# EAGLE design Duodecima (EAGLE 5.11)
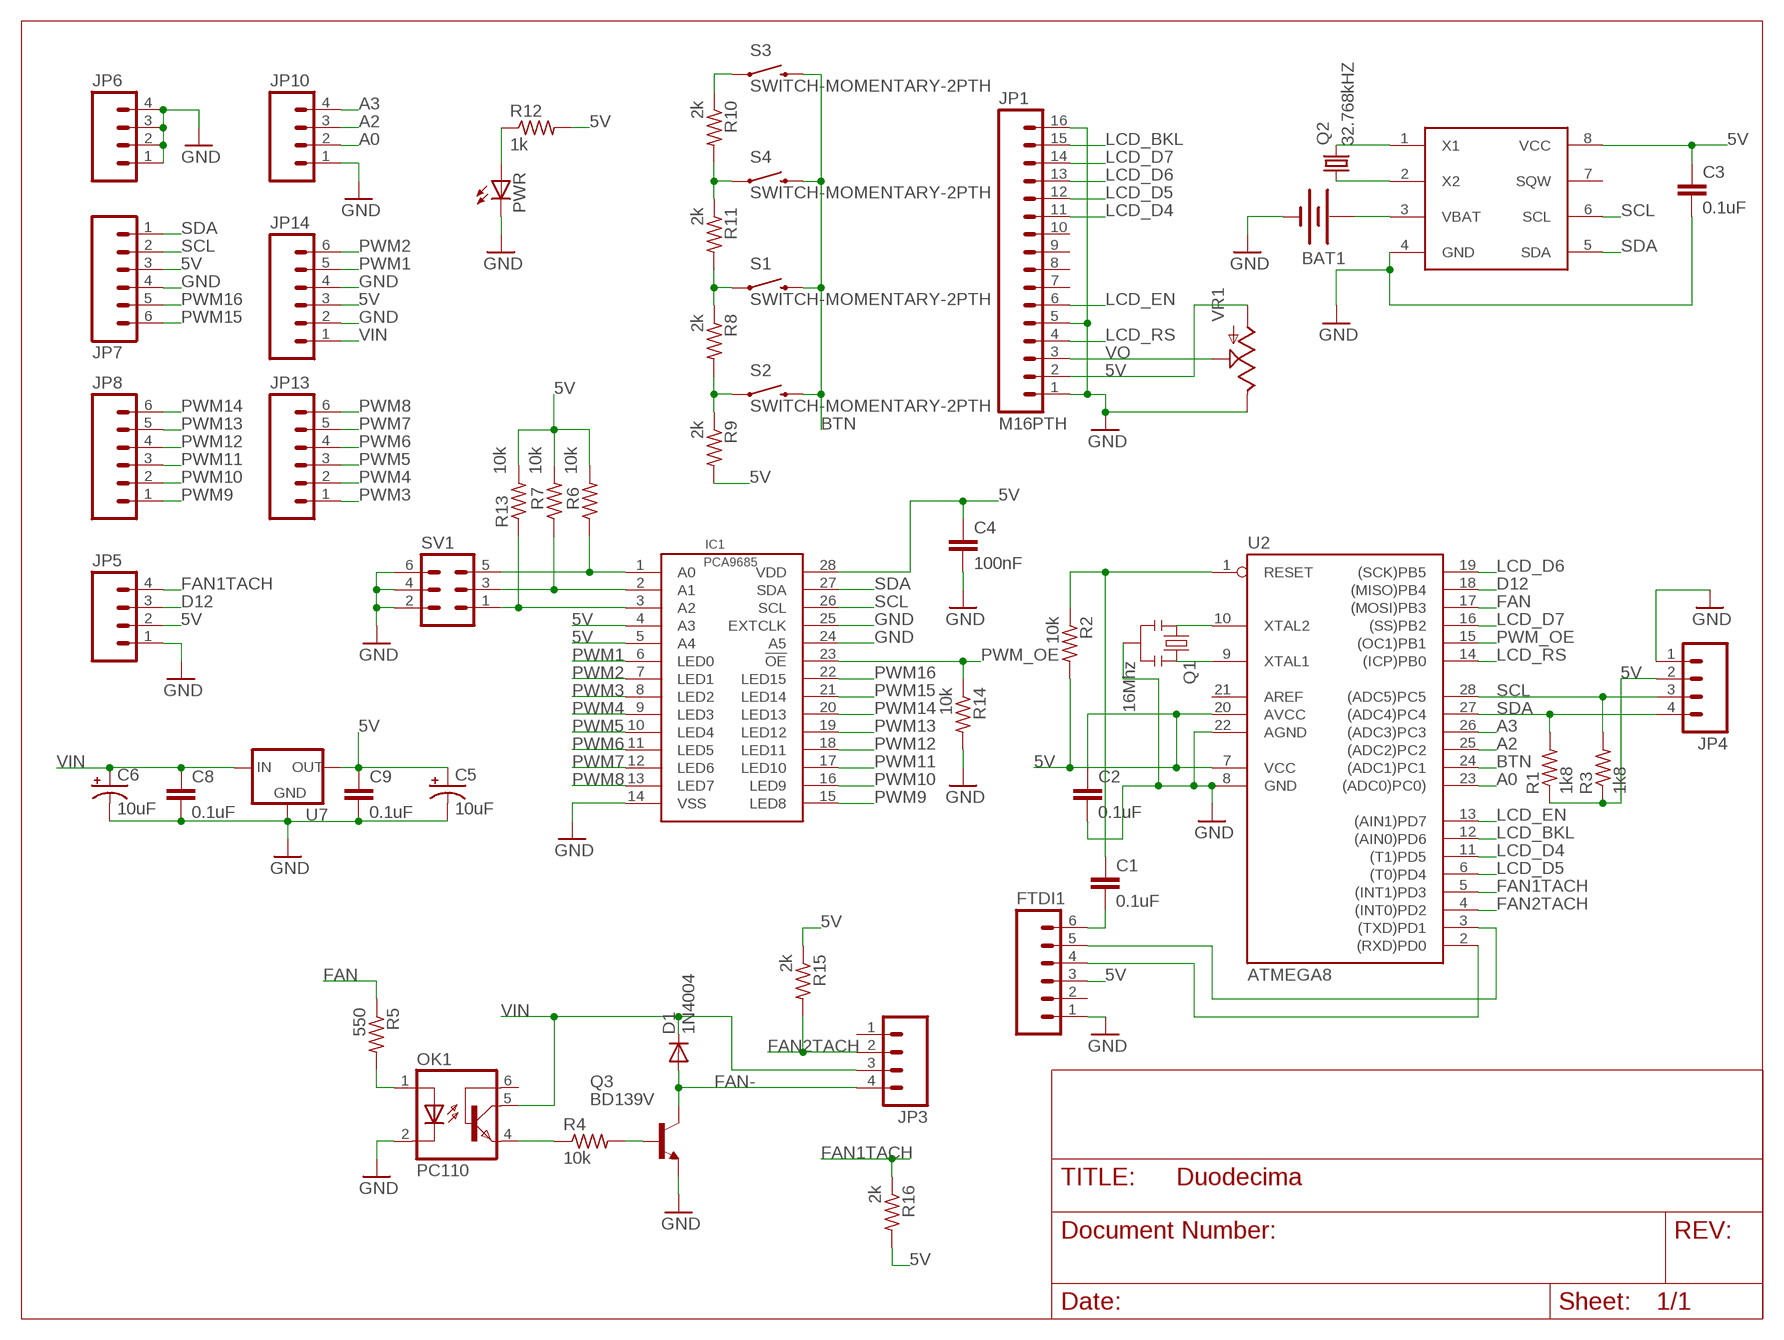
[diagram p0: schematic, sheet 1]

## Parts
BAT1  BATTERY12PTH_KEYSTONE  [BATT_12MM_KEYSTONE]
C1  0.1uF  CAP1206  [C1206]
C2  0.1uF  CAP1206  [C1206]
C3  0.1uF  CAP1206  [C1206]
C4  100nF  CAP1206  [C1206]
C5  10uF  CAP_POL6.3MMPTH  [CAP6.3MM2.5MM]
C6  10uF  CAP_POL6.3MMPTH  [CAP6.3MM2.5MM]
C8  0.1uF  CAPPTH  [CAP-PTH-SMALL]
C9  0.1uF  CAPPTH  [CAP-PTH-SMALL]
D1  1N4004  [DO41-10]
FTDI1  M06SIP  [1X06]
IC1  PCA9685TSSOP  [TSSOP28]
JP1  M16PTH  [1X16]
JP3  M04PTH  [1X04]
JP4  M04PTH  [1X04]
JP5  M04PTH  [1X04]
JP6  M04PTH  [1X04]
JP7  M06SCREW3.5MM6  [SCREWTERMINAL-3.5MM-6]
JP8  M06SCREW3.5MM6  [SCREWTERMINAL-3.5MM-6]
JP10  M04PTH  [1X04]
JP13  M06SCREW3.5MM6  [SCREWTERMINAL-3.5MM-6]
JP14  M06SCREW3.5MM6  [SCREWTERMINAL-3.5MM-6]
OK1  PC110  [DIL06]
PWR  LED3MM  [LED3MM]
Q1  16Mhz  RESONATORPTH  [RESONATOR-PTH]
Q2  32.768kHZ  CRYSTALTC26H  [TC26H]
Q3  BD139V  [TO126V]
R1  1k8  R-US_R1206  [R1206]
R2  10k  R-US_R1206  [R1206]
R3  1k8  R-US_R1206  [R1206]
R4  10k  R-US_R1206  [R1206]
R5  550  R-US_R1206  [R1206]
R6  10k  R-US_R1206  [R1206]
R7  10k  R-US_R1206  [R1206]
R8  2k  R-US_R1206  [R1206]
R9  2k  R-US_R1206  [R1206]
R10  2k  R-US_R1206  [R1206]
R11  2k  R-US_R1206  [R1206]
R12  1k  R-US_R1206  [R1206]
R13  10k  R-US_R1206  [R1206]
R14  10k  R-US_R1206  [R1206]
R15  2k  R-US_R1206  [R1206]
R16  2k  R-US_R1206  [R1206]
S1  SWITCH-MOMENTARY-2PTH  [TACTILE-PTH]
S2  SWITCH-MOMENTARY-2PTH  [TACTILE-PTH]
S3  SWITCH-MOMENTARY-2PTH  [TACTILE-PTH]
S4  SWITCH-MOMENTARY-2PTH  [TACTILE-PTH]
SV1  MA03-2  [MA03-2]
U1  DS1307SOIC8  [SO08]
U2  ATMEGA8  AT90S4433P  [DIL28-3]
U7  V_REG_78XX  [TO220AHV]
VR1  POT  [TRIM_POT_SIDE]

## Nets
5V [Power]: C2.1 C3.1 C4.1 C5.P$2(+) C9.1 FTDI1.3 IC1.4(A3) IC1.5(A4) IC1.28(VDD) JP1.2 JP4.2 JP5.2 JP7.3 JP14.3 R1.1 R2.2 R3.1 R6.2 R7.2 R9.2 R12.2 R13.2 R15.1 R16.2 U1.8(VCC) U2.7(VCC) U2.20(AVCC) U7.E(OUT) VR1.P$3(A)
A0: JP10.2 U2.23((ADC0)PC0))
A2: JP10.3 U2.25((ADC2)PC2)
A3: JP10.4 U2.26((ADC3)PC3)
BTN: S1.3 S2.3 S3.3 S4.3 U2.24((ADC1)PC1)
D12: JP5.3 U2.18((MISO)PB4)
FAN: R5.1 U2.17((MOSI)PB3)
FAN1TACH: JP5.4 R16.1 U2.5((INT1)PD3)
FAN2TACH: JP3.2 R15.2 U2.4((INT0)PD2)
FAN-: D1.A JP3.4 Q3.2(C)
GND [Power]: BAT1.GND(-) C2.2 C3.2 C4.2 C5.P$1(-) C6.P$1(-) C8.2 C9.2 FTDI1.1 IC1.14(VSS) IC1.24(A5) IC1.25(EXTCLK) JP1.1 JP1.5 JP1.16 JP4.1 JP5.1 JP6.1 JP6.2 JP6.3 JP6.4 JP7.4 JP10.1 JP14.2 JP14.4 OK1.2(C) PWR.K(C) Q1.2 Q3.1(E) R14.2 SV1.2 SV1.4 SV1.6 U1.4(GND) U2.8(GND) U2.22(AGND) U7.C(GND) VR1.P$1(E)
LCD_BKL: JP1.15 U2.12((AIN0)PD6)
LCD_D4: JP1.11 U2.11((T1)PD5)
LCD_D5: JP1.12 U2.6((T0)PD4)
LCD_D6: JP1.13 U2.19((SCK)PB5)
LCD_D7: JP1.14 U2.16((SS)PB2)
LCD_EN: JP1.6 U2.13((AIN1)PD7)
LCD_RS: JP1.4 U2.14((ICP)PB0)
N$1: Q2.1 U1.2(X2)
N$2: Q2.2 U1.1(X1)
N$3: BAT1.V+(+) U1.3(VBAT)
N$4: PWR.A R12.1
N$5: R10.1 S3.1
N$7: OK1.4(EMI) R4.1
N$8: Q3.3(B) R4.2
N$9: C1.1 R2.1 U2.1(RESET)
N$10: OK1.1(A) R5.2
N$13: R10.2 R11.1 S4.1
N$15: R8.1 R11.2 S1.1
N$16: R8.2 R9.1 S2.1
N$17: IC1.1(A0) R6.1 SV1.5
N$18: IC1.2(A1) R7.1 SV1.3
N$19: IC1.3(A2) R13.1 SV1.1
N$36: Q1.3 U2.9(XTAL1)
N$38: Q1.1 U2.10(XTAL2)
N$49: FTDI1.4 U2.2((RXD)PD0)
N$50: FTDI1.5 U2.3((TXD)PD1)
N$51: C1.2 FTDI1.6
PWM1: IC1.6(LED0) JP14.5
PWM2: IC1.7(LED1) JP14.6
PWM3: IC1.8(LED2) JP13.1
PWM4: IC1.9(LED3) JP13.2
PWM5: IC1.10(LED4) JP13.3
PWM6: IC1.11(LED5) JP13.4
PWM7: IC1.12(LED6) JP13.5
PWM8: IC1.13(LED7) JP13.6
PWM9: IC1.15(LED8) JP8.1
PWM10: IC1.16(LED9) JP8.2
PWM11: IC1.17(LED10) JP8.3
PWM12: IC1.18(LED11) JP8.4
PWM13: IC1.19(LED12) JP8.5
PWM14: IC1.20(LED13) JP8.6
PWM15: IC1.21(LED14) JP7.6
PWM16: IC1.22(LED15) JP7.5
PWM_OE: IC1.23(!OE!) R14.1 U2.15((OC1)PB1)
SCL: IC1.26(SCL) JP4.3 JP7.2 R3.2 U1.6(SCL) U2.28((ADC5)PC5)
SDA: IC1.27(SDA) JP4.4 JP7.1 R1.2 U1.5(SDA) U2.27((ADC4)PC4)
VIN [Power]: C6.P$2(+) C8.1 D1.C JP3.3 JP14.1 OK1.5(COL) U7.B(IN)
VO: JP1.3 VR1.P$2(S)
Unconnected: FTDI1.2 JP1.7 JP1.8 JP1.9 JP1.10 JP3.1 OK1.6(BAS) U1.7(SQW) U2.21(AREF)

## Library data of the parts
BAT1 = _allyourbase:BATTERY: Battery Holders Various common sizes : AA, AAA, 20mm coin cell and 12mm coin cell.
C1-C4 C8 C9 = _allyourbase:CAP: Capacitor Standard 0603 ceramic capacitor, and 0.1" leaded capacitor.
C5 C6 = _allyourbase:CAP_POL: Capacitor Polarized These are standard SMD and PTH capacitors. Normally 10uF, 47uF, and 100uF in electrolytic and tantalum varieties. Always verify the external diameter of the through hole cap, it varies with capacity, voltage, and manufacturer. The EIA devices should be standard.
D1 = diode:1N4004: DIODE general purpose rectifier, 1 A
FTDI1 JP7 JP8 JP13 JP14 = _allyourbase:M06: Header 6 Standard 6-pin 0.1" header. Use with straight break away headers (SKU : PRT-00116), right angle break away headers (PRT-00553), swiss pins (PRT-00743), machine pins (PRT-00117), and female headers (PRT-00115). Molex polarized connector foot print use with SKU : PRT-08094 with associated crimp pins and housings. NOTES ON THE VARIANTS LOCK and LOCK_LONGPADS... This footprint was designed to help hold the alignment of a through-hole component (i.e. 6-pin header) while soldering it into place. You may notice that each hole has been shifted either up or down by 0.005 of an inch from it's more standard position (which is a perfectly straight line). This slight alteration caused the pins (the squares in the middle) to touch the edges of the holes. Because they are alternating, it causes a "brace" to hold the component in place. 0.005 has proven to be the perfect amount of "off-center" position when using our standard breakaway headers. Although looks a little odd when you look at the bare footprint, once you have a header in there, the alteration is very hard to notice. Also, if you push a header all the way into place, it is covered up entirely on the bottom side. This idea of altering the position of holes to aid alignment will be further integrated into the Sparkfun Library for other footprints. It can help hold any component with 3 or more connection pins.
IC1 = pca9685:PCA9685: PCA9685 16-channel, 12-bit PWM Fm+ I2C-bus LED controller The PCA9685 is an I2C-bus controlled 16-channel LED controller optimized for LCD Red/Green/Blue/Amber (RGBA) color backlighting applications. Each LED output has its own 12-bit resolution (4096 steps) fixed frequency individual PWM controller that operates at a programmable frequency from a typical of 40 Hz to 1000 Hz with a duty cycle that is adjustable from 0 % to 100 % to allow the LED to be set to a specific brightness value. All outputs are set to the same PWM frequency. Each LED output can be off or on (no PWM control), or set at its individual PWM controller value. The LED output driver is programmed to be either open-drain with a 25 mA current sink capability at 5 V or totem pole with a 25 mA sink, 10 mA source capability at 5 V. ThePCA9685 operates with a supply voltage range of 2.3 V to 5.5 V and the inputs and outputs are 5.5 V tolerant. LEDs can be directly connected to the LED output (up to 25 mA, 5.5 V) or controlled with external drivers and a minimum amount of discrete components for larger current or higher voltage LEDs. The PCA9685 is in the new Fast-mode Plus (Fm+) family. Fm+ devices offer higher frequency (up to 1 MHz) and more densely populated bus operation (up to 4000 pF). Although the PCA9635 and PCA9685 have many similar features, the PCA9685 has some unique features that make it more suitable for applications such as LCD backlighting and Ambilight
JP1 = _allyourbase:M16
JP3-JP6 JP10 = _allyourbase:M04: Header 4 Standard 4-pin 0.1" header. Use with straight break away headers (SKU : PRT-00116), right angle break away headers (PRT-00553), swiss pins (PRT-00743), machine pins (PRT-00117), and female headers (PRT-00115). Molex polarized connector foot print use with SKU : PRT-08231 with associated crimp pins and housings.
OK1 = optocoupler:PC110: SHARP OPTO COUPLER; OC_FARNELL: unknown; OC_NEWARK: unknown
PWR = _allyourbase:LED: LEDs Standard schematic elements and footprints for 5mm, 3mm, 1206, and 0603 sized LEDs. 5mm - Spark Fun Electronics SKU : COM-00529 (and others)
Q1 = _allyourbase:RESONATOR: Resonator Small SMD resonator. This is the itty bitty 10/20MHz resonators with built in caps. CSTCE10M0G55 and CSTCE20M0V53. Footprint has been reviewed closely but hasn't been tested yet.
Q2 = _allyourbase:CRYSTAL: CRYSTAL
Q3 = TRANSISTOR_TO126:BD139*: NPN Transistor
R1-R16 = _allyourbase:R-US_: RESISTOR, American symbol
S1-S4 = _allyourbase:SWITCH-MOMENTARY-2
SV1 = con-lstb:MA03-2: PIN HEADER; OC_FARNELL: unknown; OC_NEWARK: unknown
U1 = _allyourbase:DS1307
U2 = atmel:AT90S4433: MICROCONTROLLER 4 Kbytes FLASH 128 bytes SRAM 256 bytes EEPROM UART 6-channel 10 bit ADC
U7 = _allyourbase:V_REG_78XX: Voltage Regulator Standard 7805 5V regulator. IGO (Input Ground Output). Spark Fun Electronics SKU : COM-00107
VR1 = _allyourbase:POT

## Net classes
0 default: width 0.254 mm, drill 0.508 mm
1 Power: width 0.305 mm, drill 0.508 mm

## Board
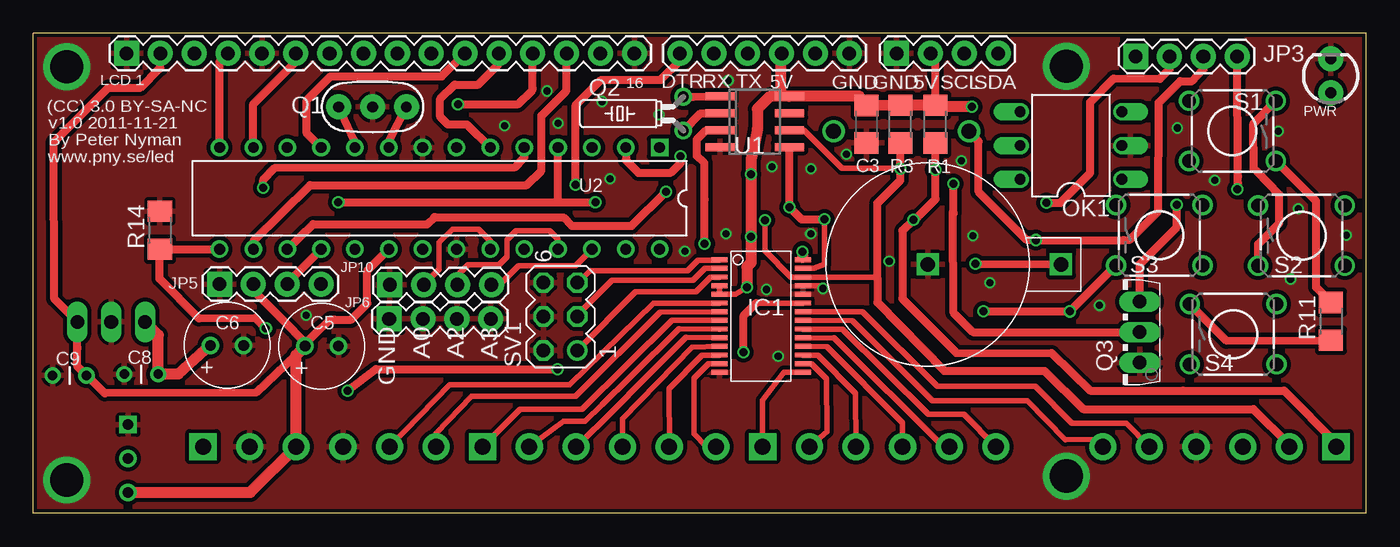
[diagram p1: board, top side]
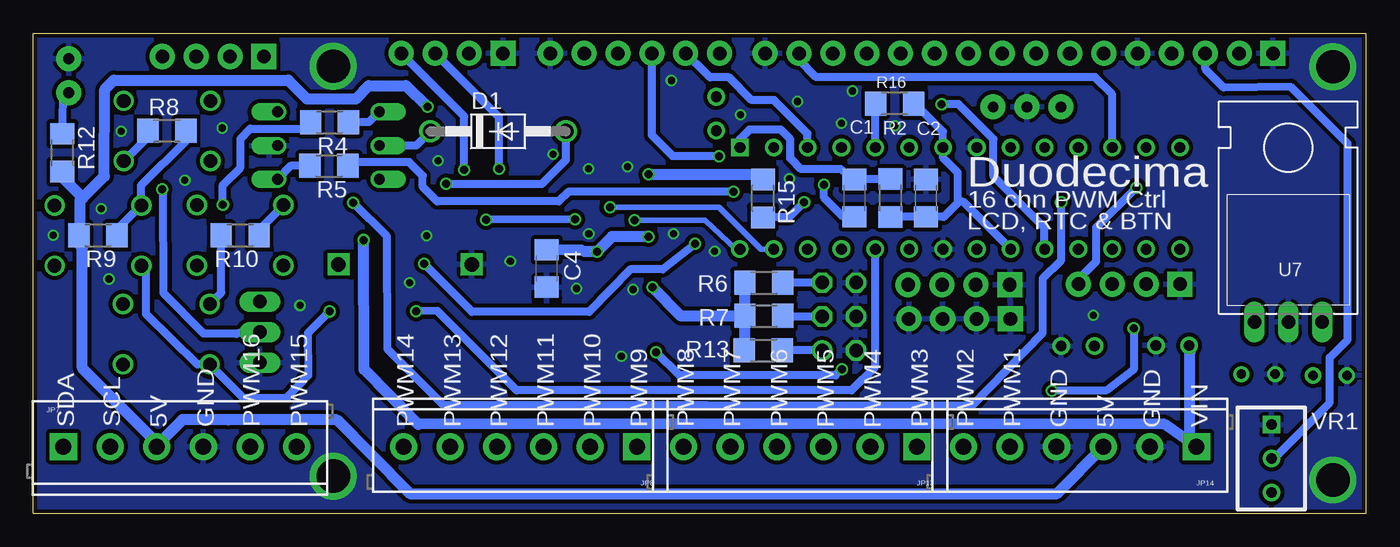
[diagram p2: board, bottom side, seen from below]

Size 100 x 36 mm. Coordinates in mm from the lower left corner, seen from the top.
Outline: 100,0 0,0 0,36 100,36 100,0
Copper layers (1*16): Top 0.035mm / dielectric 1.5mm / Bottom 0.035mm
Design rules "iTead-Seeed-DRC": minimum track width 6mil, minimum drill 12mil, track to track 6mil, track to pad 6mil, pad to pad 6mil, via to via 6mil, smd to smd 0mil, copper to edge 10mil, drill to drill 10mil, minimum pad ring 10mil, minimum via ring 6mil, stop-mask expansion 2mil, vias tented up to drill 100mil, thermal gap 10mil

### Footprints (pad centres in the part's own frame; a part is rotated, then mirrored left to right if it is on the bottom)
BATT_12MM_KEYSTONE = drill 1.1 square: GND 0,0; V+ 10,0
C1206 = smd 1.6 x 1.8: 1 -1.4,0; 2 1.4,0
CAP6.3MM2.5MM = drill 0.8 round: P$1 -1.25,0; P$2 1.25,0
CAP-PTH-SMALL = drill 0.7 round: 1 0,0; 2 2.54,0
DO41-10 = drill 1.118 round: A 5.08,0; C -5.08,0
1X06 = drill 1.016 pad 1.88 round: 1 0,0; 2 2.54,0; 3 5.08,0; 4 7.62,0; 5 10.16,0; 6 12.7,0
TSSOP28 = smd 1.2 x 0.37: 1 -3.125,0; 2 -3.125,-0.65; 3 -3.125,-1.3; 4 -3.125,-1.95; 5 -3.125,-2.6; 6 -3.125,-3.25; 7 -3.125,-3.9; 8 -3.125,-4.55; 9 -3.125,-5.2; 10 -3.125,-5.85; 11 -3.125,-6.5; 12 -3.125,-7.15; 13 -3.125,-7.8; 14 -3.125,-8.45; 15 3.125,-8.45; 16 3.125,-7.8; 17 3.125,-7.15; 18 3.125,-6.5; 19 3.125,-5.85; 20 3.125,-5.2; 21 3.125,-4.55; 22 3.125,-3.9; 23 3.125,-3.25; 24 3.125,-2.6; 25 3.125,-1.95; 26 3.125,-1.3; 27 3.125,-0.65; 28 3.125,0
1X16 = drill 1.016 pad 1.88 square: 1 0,0 | drill 1.016 pad 1.88 round: 2 2.54,0; 3 5.08,0; 4 7.62,0; 5 10.16,0; 6 12.7,0; 7 15.24,0; 8 17.78,0; 9 20.32,0; 10 22.86,0; 11 25.4,0; 12 27.94,0; 13 30.48,0; 14 33.02,0; 15 35.56,0; 16 38.1,0
1X04 = drill 1.016 pad 1.88 square: 1 0,0 | drill 1.016 pad 1.88 round: 2 2.54,0; 3 5.08,0; 4 7.62,0
SCREWTERMINAL-3.5MM-6 = drill 1.2 pad 2.032 square: 1 0,0 | drill 1.2 pad 2.032 round: 2 3.5,0; 3 7,0; 4 10.5,0; 5 14,0; 6 17.5,0
DIL06 = drill 0.813 offset: 1 -2.54,-3.81; 2 0,-3.81; 3 2.54,-3.81; 4 2.54,3.81; 5 0,3.81; 6 -2.54,3.81
LED3MM = drill 0.813 pad 1.88 round: A -1.27,0; K 1.27,0
RESONATOR-PTH = drill 0.8 pad 1.88 round: 1 -2.54,0; 2 0,0; 3 2.54,0
TC26H = drill 0.813 round: 1 -1.27,0; 2 1.27,0
TO126V = drill 1.016 long: 1 -2.286,-1.27; 2 0,-1.27; 3 2.286,-1.27
R1206 = smd 1.6 x 1.803: 1 -1.422,0; 2 1.422,0
TACTILE-PTH = drill 1.016 round: 1 -3.251,2.261; 2 3.251,2.261; 3 -3.251,-2.261; 4 3.251,-2.261
MA03-2 = drill 1.016 round: 1 -2.54,-1.27 | drill 1.016 octagon: 2 -2.54,1.27; 3 0,-1.27; 4 0,1.27; 5 2.54,-1.27; 6 2.54,1.27
SO08 = smd 0.6 x 2.2: 1 -1.905,-2.6; 2 -0.635,-2.6; 3 0.635,-2.6; 4 1.905,-2.6; 5 1.905,2.6; 6 0.635,2.6; 7 -0.635,2.6; 8 -1.905,2.6
DIL28-3 = drill 0.813 square: 1 -16.51,-3.81 | drill 0.813 round: 2 -13.97,-3.81; 3 -11.43,-3.81; 4 -8.89,-3.81; 5 -6.35,-3.81; 6 -3.81,-3.81; 7 -1.27,-3.81; 8 1.27,-3.81; 9 3.81,-3.81; 10 6.35,-3.81; 11 8.89,-3.81; 12 11.43,-3.81; 13 13.97,-3.81; 14 16.51,-3.81; 15 16.51,3.81; 16 13.97,3.81; 17 11.43,3.81; 18 8.89,3.81; 19 6.35,3.81; 20 3.81,3.81; 21 1.27,3.81; 22 -1.27,3.81; 23 -3.81,3.81; 24 -6.35,3.81; 25 -8.89,3.81; 26 -11.43,3.81; 27 -13.97,3.81; 28 -16.51,3.81
TO220AHV = drill 1.016 long: B -2.54,-1.905; C 0,-1.905; E 2.54,-1.905
TRIM_POT_SIDE = drill 0.8 square: P$1 0,2.54 | drill 0.8 round: P$2 0,0; P$3 0,-2.54

### Placement (x,y rotation side)
BAT1  67.11,18.67 0 top
C1  38.38,23.65 270 bottom
C2  33.02,23.65 90 bottom
C3  62.51,29.18 270 top
C4  61.49,18.36 270 bottom
C5  21.64,12.55 180 top
C6  14.53,12.6 180 top
C8  9.37,10.44 180 top
C9  3.99,10.34 180 top
D1  65.13,28.65 0 bottom
FTDI1  61.21,34.5 180 top
IC1  54.61,19.02 0 top
JP1  6.99,34.5 0 top
JP3  82.7,34.26 0 top
JP4  64.77,34.5 0 top
JP5  13.97,17.2 0 top
JP6  26.7,14.58 0 top
JP7  97.74,5 0 bottom
JP8  54.72,5 180 bottom
JP10  26.75,17.14 0 top
JP13  33.71,5 180 bottom
JP14  12.73,5 180 bottom
OK1  77.85,27.58 90 top
PWR  97.33,32.82 90 top
Q1  25.45,30.48 0 top
Q2  48.77,29.97 90 top
Q3  81.74,13.59 90 top
R1  67.67,29.18 270 top
R2  35.69,23.65 270 bottom
R3  65.05,29.18 270 top
R4  77.77,29.34 180 bottom
R5  77.83,26.06 180 bottom
R6  45.19,17.3 180 bottom
R7  45.19,14.81 180 bottom
R8  89.97,28.68 0 bottom
R9  95.15,20.85 180 bottom
R10  84.48,20.85 180 bottom
R11  97.36,14.4 90 top
R12  97.82,27.05 270 bottom
R13  45.24,12.22 180 bottom
R14  9.5,21.23 90 top
R15  45.26,23.62 270 bottom
R16  35.38,30.73 0 bottom
S1  89.97,28.68 180 top
S2  95.15,20.83 0 top
S3  84.48,20.85 0 top
S4  90.02,13.44 0 top
SV1  39.55,14.76 90 top
U1  54.13,29.36 270 top
U2  30.48,23.62 180 top
U7  5.84,16.26 0 bottom
VR1  7.11,4.11 0 bottom

### Tracks (layer width: path | path; a pad name or v marks a point on that pad's centre or on a via)
5V  (via drill 0.6)
  Top 0.406: 56.08,34.45 FTDI1.3 | 62.18,30.56 C3.1 | 3.3,12.37 3.3,12.42 | 4.01,10.34 C9.1 | 67.28,30.48 R1.1 | 57.71,19.2 57.73,19.23 IC1.28 | v53.54,16.94 52.67,16.43 IC1.5 IC1.4
  Top 0.61: JP1.2 9.53,34.28 9.53,33.38 9.5,33.38 8.05,31.93 5.61,31.93 2.23,28.55 1.55,27.84 1.57,16.08 U7.E 3.3,12.42 | R1.1 67.67,33.92 JP4.2 | 3.3,12.37 3.3,11.02 C9.1 | 20.42,12.77 C5.P$2 16.71,9.05 5.36,9 4.01,10.34 | 20.42,12.77 21.49,13.82 22.3,14.55 | 22.3,14.55 22.53,14.55 | 22.3,14.55 22.58,14.53 23.85,14.53 25.04,15.72 25.04,18.21 U2.20 | JP5.2 16.51,16.71 18.19,15.04 18.79,14.43 20.42,12.77
  Top 0.813: R1.1 R3.1 62.18,30.56 | VR1.P$3 16.27,1.57 JP14.3 19.7,11.86 C5.P$2 | C3.1 61.95,31.29 U1.8 | U1.8 56.08,31.29 56.08,34.45 | v70.43,30.48 67.28,30.48 | U1.8 55.27,31.27 54.33,30.33 54.33,28.83 54.03,27.38 53.85,26.54 v53.85,25.43 v53.85,20.75 53.85,18.8 53.54,18.49 v53.54,16.94 | v57.71,19.64 57.71,19.2
  Bottom 0.406: 32.72,22.23 C2.1 | R7.2 46.66,14.76 | R9.2 96.57,20.75 | R9.2 96.5,20.93 | 96.57,20.22 R9.2 | 97.79,25.15 R12.2
  Bottom 0.61: U2.20 30.2,23.37 30.63,23.37 | 30.63,23.37 30.63,23.29 31.7,22.23 32.72,22.23 R2.2 | 30.63,23.37 30.63,25.55 31.75,26.67 U2.7 31.75,28.63 33.43,30.3 R16.2
  Bottom 0.813: JP14.3 23.26,1.45 71.68,1.45 74.65,4.42 77.22,7.01 85.37,7.01 88.8,7.04 90.74,5.07 JP7.3 90.73,5.31 96.32,10.9 96.32,19.89 96.57,20.22 | v70.43,30.48 72.03,32.08 74.83,32.08 75.79,31.09 79.48,31.09 80.87,32.49 93.95,32.49 94.64,31.8 94.67,25.27 96.28,23.66 | 46.66,14.76 R13.2 | v53.54,16.94 51.44,14.81 R7.2 R6.2 | v53.85,20.75 56.59,20.75 v57.71,19.64 58.65,19.63 58.88,19.74 59.69,19.74 C4.1 | 96.28,23.66 96.5,23.44 96.5,20.93 | R15.1 45.92,25.43 53.47,25.43 v53.85,25.43 | 96.28,23.66 97.79,25.15
A0
  Top 0.406: U2.23 34.29,20.42 33.4,21.31 31.45,21.31 30.45,20.32 30.45,18.31 JP10.2
A2
  Top 0.406: JP10.3 31.83,17.86 32.61,18.64 34.95,18.64 35.56,19.25 35.56,20.52 36.22,21.18 38.73,21.18 39.37,20.55 U2.25
A3
  Top 0.406: JP10.4 34.98,17.14 36.4,18.57 40.66,18.57 U2.26
BTN  (via drill 0.6)
  Top 0.61: S2.3 91.9,20.19 93.47,21.74 93.5,23.9 91.82,25.63 91.57,25.86 91.54,29.23 S1.3 | v71.27,15.16 v77.78,15.14 S3.3
  Bottom 0.61: U2.24 36.83,11 38.61,9.22 63.73,9.22 69.7,15.19 v71.27,15.16 | S2.3 91.9,18.54 91.54,18.24 91.54,14.94 87.71,11.18 S4.3 84.23,8.64 81.03,8.64 79.38,10.34 79.4,13.51 v77.78,15.14
D12
  Top 0.406: JP5.3 19.05,17.27
  Top 0.61: 19.05,17.27 U2.18
FAN  (via drill 0.6)
  Top 0.61: U2.17 20.98,21.69 29.54,21.67 30.1,22.23 30.12,22.23 39.78,22.2 40.39,21.57 44.88,21.57 v47.47,24.13
  Bottom 0.406: 75.74,26.34 75.79,26.19 75.92,26.06 R5.1
  Bottom 0.61: v47.47,24.13 59.84,24.13 60.58,23.39 69.7,23.39 70.79,24.49 70.79,25.32 71.81,26.34 75.74,26.34
FAN1TACH  (via drill 0.6)
  Top 0.61: v17.25,24.41 17.25,25.02 18.11,25.91 36.14,25.96 36.83,26.67 U2.5
  Bottom 0.406: 36.83,30.68 R16.1
  Bottom 0.61: JP5.4 21.59,17.55 20.24,18.9 20.24,21.44 v17.25,24.41 | U2.5 36.83,30.68
FAN2TACH  (via drill 0.6)
  Top 0.61: v76,23.29 77.06,23.29 79.3,25.53 79.3,30.84 81.05,32.61 84.53,32.59 85.24,33.3 JP3.2 | v22.89,23.34 39.37,23.34 | 39.37,23.34 U2.4 | 39.37,23.34 v42.16,23.34
  Bottom 0.61: v76,23.29 73.46,20.78 73.43,12.32 69.27,8.15 29.59,8.05 24.26,13.54 24.26,17.63 22.89,19 v22.89,23.34 | R15.2 43.31,22.2 v42.16,23.34
FAN-  (via drill 0.6)
  Top 0.406: Q3.2 82.22,13.54 83.13,13.56
  Top 0.61: v69.04,24.71 69.04,22.5 69.01,22.66 69.04,15.06 70.51,13.59 83.13,13.56 | v90.32,24.31 90.37,24.79 90.37,25.25 JP3.4
  Bottom 0.406: Q3.2 83.21,13.56
  Bottom 0.61: D1.A 60.05,26.52 61.85,24.71 v69.04,24.71 | v90.32,24.31 90.3,24.33 90.37,24.28 90.27,24.23 90.22,16.51 87.22,13.49 84.76,13.46 84.33,13.56 83.21,13.56
GND  (via drill 0.53, 2.5)
  Top 0.406: IC1.25 59.24,17.07 v59.24,16.86
  Bottom 0.406: JP10.1 26.75,17.2
  other vias: 2.5,33.5 77.5,2.79 2.5,2.5 77.5,33.53 46.95,29.89 55.89,11.78 98.51,20.85 88.63,24.99 70.49,20.81 39.38,29.26 20.46,14.86 69.63,26.44 55,16.79 58.33,20.98 51.98,20.98 48.88,19.66 43.27,25.09 38.54,31.67 94.32,17.57 85.84,28.9 93.41,28.65 80,15.59 71.76,17.28 64.21,18.91 58.35,25.84 42.66,30.88 94.91,22.83 61.01,26.93 52.13,32.46 35.37,29.08 55.43,26
  pour Bottom (isolate 0.305): 0,36 99.97,36 99.97,0.03 0,0
  pour Top (isolate 0.305): 0,36 0,0 100,0 100,36
LCD_BKL
  Bottom 0.254: 42.57,34.48 JP1.15
  Bottom 0.61: U2.12 19.05,31.42 20.34,32.72 41.26,32.72 42.57,34.01 42.57,34.48
LCD_D4
  Top 0.61: U2.11 20.52,28.5 20.52,30.99 22.3,32.77 30.64,32.77 JP1.11
LCD_D5
  Top 0.61: U2.6 32.54,29.16 31.11,29.16 30.53,29.74 30.53,31.09 31.61,32.16 33.38,32.16 34.92,33.73 JP1.12
LCD_D6  (via drill 0.6)
  Top 0.61: JP1.13 37.47,34.48 37.47,31.88 37.44,31.75 36.37,30.68 v31.85,30.68
  Bottom 0.61: v31.85,30.68 30.58,30.68 27.96,28.07 27.96,25.27 24.13,21.41 U2.19
LCD_D7
  Top 0.254: 40.01,34.44 JP1.14
  Top 0.61: 40.01,34.44 40.01,31.7 39.17,30.87 38.12,29.83 38.12,25.7 37.01,24.61 20.75,24.61 16.51,20.4 U2.16
LCD_EN
  Top 0.61: U2.13 16.51,30.68 19.58,33.76 19.68,33.93 JP1.6
LCD_RS
  Top 0.61: JP1.4 13.97,33.84 U2.14
N$1
  Top 0.61: Q2.1 50.06,30 U1.2
N$2
  Top 0.61: U1.1 49.53,31.24 Q2.2
N$3  (via drill 0.6)
  Top 0.61: v70.68,18.71 BAT1.V+ | v50.37,20.22 50.37,23.52 50.34,24.66 50.34,26.29 50.29,26.31 49.78,26.8 49.78,28.04 50.47,28.73 U1.3
  Bottom 0.61: v70.68,18.71 67.08,15.11 58.29,15.11 55.19,18.29 52.78,18.29 v50.37,20.22
N$4
  Bottom 0.61: R12.1 97.77,30.96 97.56,31.29 PWR.A
N$5
  Bottom 0.406: R10.1 83.06,21.29
  Bottom 0.61: 83.06,21.29 S3.1
N$7
  Bottom 0.61: R4.1 74.83,29.34 OK1.4
N$8  (via drill 0.6)
  Top 0.61: v85.78,23.14 85.78,21.46 83.01,18.69 Q3.3
  Bottom 0.406: 79.68,28.85 R4.2
  Bottom 0.61: v85.78,23.14 85.78,24.61 84.45,25.93 84.45,28.09 83.72,28.85 79.68,28.85
N$9
  Bottom 0.406: 38.3,25.07 C1.1
  Bottom 0.61: U2.1 46.99,28.07 46.28,28.78 43.92,28.78 43.2,28.04 43.2,26.62 42.39,25.81 39.42,25.81 C1.1 | R2.1 38.3,25.07
N$10
  Bottom 0.61: OK1.1 80.7,26.06 R5.2
N$13
  Top 0.61: R11.1 89.51,12.95 S4.1
  Bottom 0.61: R10.2 85.9,16.56 S4.1
N$15
  Top 0.406: 93.24,26.42 S1.1
  Top 0.61: R11.2 96.24,16.94 96.24,23.42 93.24,26.42
  Bottom 0.406: 91.39,28.25 R8.1
  Bottom 0.61: S1.1 91.39,28.25
N$16
  Bottom 0.406: R9.1 93.73,21.26 | R8.2
  Bottom 0.61: 93.73,21.26 S2.1 91.92,23.24 91.92,24.59 88.54,27.94 R8.2
N$17
  Top 0.406: SV1.5 41.76,18.21 49.07,18.21 49.89,19 51.46,19 IC1.1
  Bottom 0.61: SV1.5 R6.1
N$18
  Top 0.406: IC1.2 50.4,18.38 49.51,17.48 43.41,17.48 40.92,14.96 SV1.3
  Bottom 0.406: 43.71,14.76 R7.1
  Bottom 0.61: SV1.3 43.71,14.76
N$19
  Top 0.406: IC1.3 50.82,17.73 49.71,16.64 45.19,16.64 SV1.1
  Bottom 0.61: SV1.1 R13.1
N$36
  Top 0.61: U2.9 26.7,27.94 Q1.3
N$38
  Top 0.61: U2.10 24.13,27.86 24.08,27.91 24.08,27.96 24.05,27.99 Q1.1
N$49  (via drill 0.6)
  Top 0.61: U2.2 44.45,26.49 45.39,25.53 47.83,25.55 48.56,26.26 v48.56,26.8
  Bottom 0.61: v48.56,26.8 52.02,26.8 | 52.02,26.8 52.05,26.8 | 52.02,26.8 53.59,28.37 FTDI1.4
N$50
  Bottom 0.61: U2.3 41.91,28.47 44.42,30.99 46.1,30.99 47.8,32.69 49.23,32.69 49.51,32.95 FTDI1.5
N$51  (via drill 0.6)
  Top 0.61: FTDI1.6 48.51,33.96 47.07,32.51 42.6,32.51 40.69,30.61 v40.66,24.64
  Bottom 0.61: C1.2 39.24,22.25 40.66,23.67 v40.66,24.64
PWM1
  Top 0.406: IC1.6 46.53,15.78 40.23,9.63 31.25,9.65 JP14.5
PWM2
  Top 0.406: IC1.7 47,15.1 40.69,8.76 32.87,8.76 30.2,6.02 JP14.6
PWM3
  Top 0.406: IC1.8 47.93,14.47 41.17,7.82 36.52,7.82 JP13.1
PWM4
  Top 0.406: IC1.9 48.45,13.85 44.81,10.26 42.67,8.15 41.4,6.91 39.77,6.91 JP13.2
PWM5
  Top 0.406: IC1.10 48.95,13.2 45.74,9.98 43.56,7.77 40.74,4.98 40.73,4.98 JP13.3
PWM6
  Top 0.406: IC1.11 49.43,12.47 44.2,7.11 44.2,5.05 JP13.4
PWM7
  Top 0.406: IC1.12 50.18,11.88 47.68,9.35 47.73,5.08 JP13.5
PWM8
  Top 0.406: IC1.13 50.65,11.22 49.55,10.13 49.55,5.97 50.51,5 JP13.6
PWM9
  Top 0.406: IC1.15 56.34,10.59 54.7,8.47 JP8.1
PWM10
  Top 0.406: IC1.16 57.68,11.23 58.4,11.23 59.51,10.08 59.54,6.12 58.28,5.04 JP8.2
PWM11
  Top 0.406: JP8.3 61.72,5.06 61.7,9.02 58.86,11.88 IC1.17
PWM12
  Top 0.406: IC1.18 59.56,12.5 65.2,6.81 65.2,5.01 JP8.4
PWM13
  Top 0.381: 60.07,13.18 57.75,13.16 IC1.19
  Top 0.406: JP8.5 68.29,5.01 60.07,13.18
PWM14
  Top 0.406: IC1.20 60.7,13.8 67.16,7.44 69.81,7.44 JP8.6
PWM15
  Top 0.406: JP7.6 80.24,4.98 79.65,5.56 77.44,5.54 74.57,8.43 67.46,8.46 61.47,14.45 57.76,14.48 IC1.21
PWM16
  Top 0.406: IC1.22 62.19,15.12 67.82,9.53 75.18,9.53 77.93,6.76 81.99,6.76 JP7.5
PWM_OE  (via drill 0.6)
  Top 0.406: 54.23,15.78 IC1.23 | 9.47,19.79 R14.1 | U2.15
  Top 0.61: R14.1 U2.15 | 54.23,15.78 53.29,14.83 v53.29,12.09 | v39.34,10.82 25.7,10.82 v23.57,9.2 | v17.45,13.87 16.66,14.68 12.42,14.63 9.47,17.58 9.47,19.79
  Bottom 0.61: v53.29,12.09 51.54,10.34 39.8,10.34 v39.34,10.82 | v23.57,9.2 19.53,9.2 17.45,10.79 v17.45,13.87
SCL  (via drill 0.6)
  Top 0.406: U1.6 57.84,28.73 60.66,25.88 65.05,25.88 v65.05,25.86 | 94.18,5.18 94.24,5.18 | 63.32,17.68 63.28,17.73 IC1.26 56.85,17.73 54.89,19.68 v54.89,21.97
  Top 0.61: R3.2 v65.05,25.86 65.05,24.97 63.32,23.27 63.32,17.68 63.32,15.82 68.35,10.69 75.87,10.69 78.77,7.82 91.54,7.82 94.18,5.18 | 94.24,5.18 JP7.2
  Bottom 0.406: U2.28 47.27,19.81 49.61,22 54.63,21.97 | 54.63,21.97 v54.89,21.97 54.64,21.97 54.63,21.97
  Bottom 0.61: v65.05,25.86 65.08,29.73 JP4.3
SDA  (via drill 0.6)
  Top 0.406: IC1.27 58.58,18.38 59.36,18.67 v59.36,22.05 | 67.69,25.78 v67.67,25.78 | 97.77,5.05 JP7.1 | v66.04,22.02 65.99,21.95 | v56.74,22.96 56.74,23.01
  Top 0.61: v67.67,25.78 R1.2 | 67.69,25.78 67.69,23.57 66.06,21.95 65.99,21.95 65.2,21.21 65.2,16.1 69.24,12.04 76.4,12.01 79.3,9.2 86.26,9.2 93.85,9.2 97.77,5.26 97.77,5.05 | v56.74,22.96 56.72,22.94 | v56.74,22.96 56.74,23.01 U1.5 | v59.36,22.05 57.63,22.05 v56.74,22.96
  Bottom 0.406: U2.27 45.41,19.81 48.54,22.96 v56.74,22.96
  Bottom 0.61: v67.67,25.78 67.67,29.78 JP4.4 | v59.36,22.05 v66.04,22.02
VIN  (via drill 0.6)
  Top 0.61: JP3.3 87.78,33.3 86.94,32.41 86.06,32.41 84.43,30.81 84.4,22.66 82.27,20.52 81.81,20.5 v75.21,20.5 74.55,20.5 70.92,24.13 70.92,27.89 D1.C
  Top 0.813: C6.P$2 10.88,10.44 C8.1 9.37,13.36 U7.B
  Bottom 0.406: 13.11,5.44 13.23,5.41 13.26,5.51
  Bottom 0.61: OK1.5 71.27,27.58 D1.C
  Bottom 0.813: 13.23,5.41 13.21,12.07 C6.P$2 | v75.21,20.5 75.23,20.42 75.18,10.79 71.12,6.68 15.19,6.71 JP14.1 13.26,5.51
VO
  Bottom 0.406: VR1.P$2 6.99,4.06
  Bottom 0.61: JP1.3 12.06,34.25 12.06,33.33 10.69,31.93 5.66,31.98 1.4,27.74 1.4,13.03 2.74,11.68 2.74,8.31 6.99,4.06

### Text on the board
tNames: LCD 1 | 16 | DTR | RX | TX | 5V | GND | GND | 5V | SCL | SDA | (CC) 3.0 BY-SA-NC | v1.0 2011-11-21 | By Peter Nyman | www.pny.se/led | GND | A0 | A2 | A3
bNames: Duodecima | 16 chn PWM Ctrl | LCD, RTC & BTN | VIN | GND | 5V | GND | PWM1 | PWM2 | PWM3 | PWM4 | PWM5 | PWM6 | PWM7 | PWM8 | PWM9 | PWM10 | PWM11 | PWM12 | PWM13 | PWM14 | PWM15 | PWM16 | GND | 5V | SCL | SDA